# EAGLE design MCU (EAGLE 9.6.0)
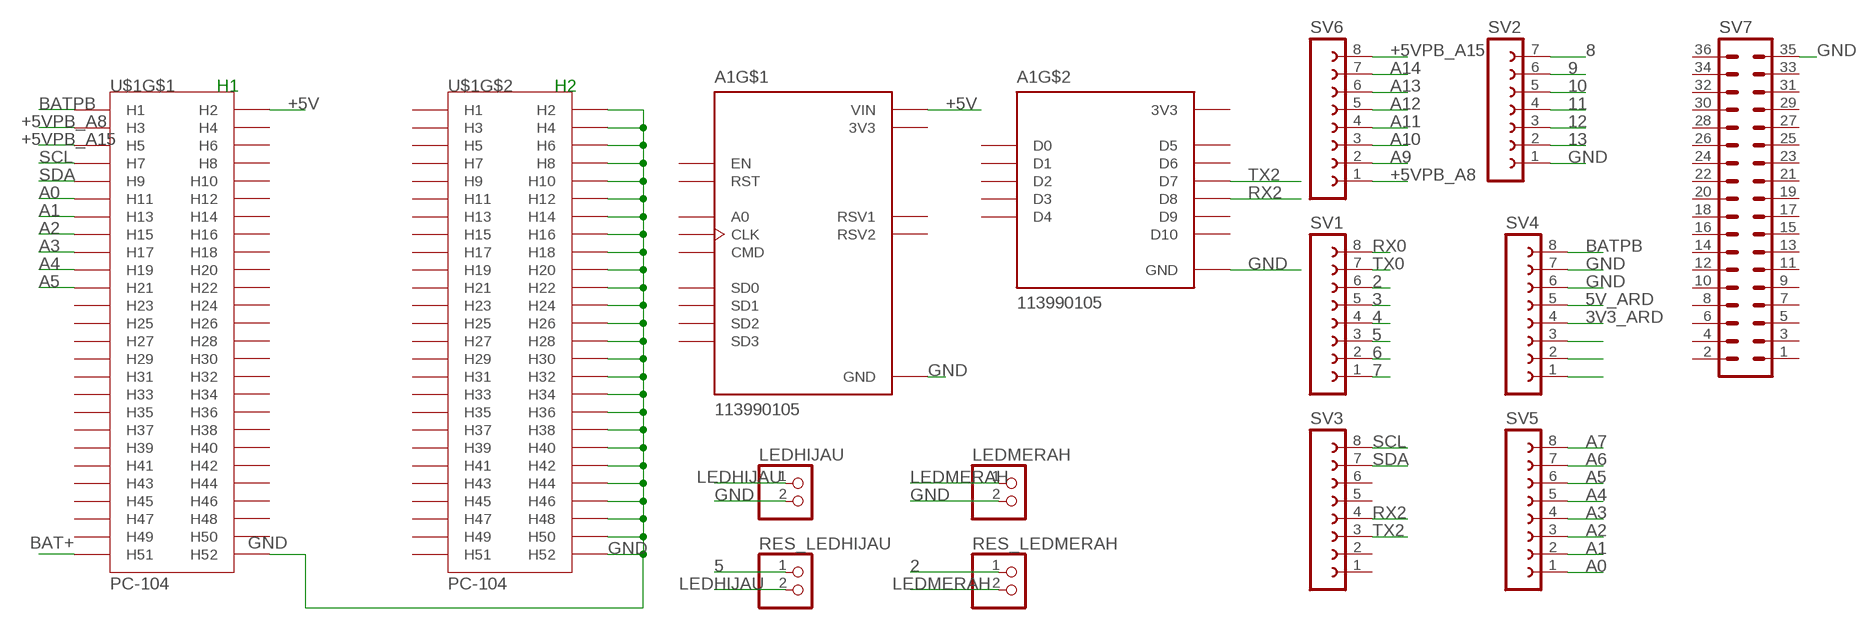
[diagram p0: schematic, sheet 1]

## Parts
A1  113990105  [SEEED_113990105]
LEDHIJAU  PINHD-1X2  [1X02]
LEDMERAH  PINHD-1X2  [1X02]
RES_LEDHIJAU  PINHD-1X2  [1X02]
RES_LEDMERAH  PINHD-1X2  [1X02]
SV1  FE08-1  [FE08]
SV2  FE07-1  [FE07]
SV3  FE08-1  [FE08]
SV4  FE08-1  [FE08]
SV5  FE08-1  [FE08]
SV6  FE08-1  [FE08]
SV7  MA18-2  [MA18-2]
U$1  PC-104  [PC-104]

## Nets
2: RES_LEDMERAH.1 SV1.6
3: SV1.5
3V3_ARD: SV4.4
4: SV1.4
5: RES_LEDHIJAU.1 SV1.3
5V_ARD: SV4.5
6: SV1.2
7: SV1.1
8: SV2.7
9: SV2.6
10: SV2.5
11: SV2.4
12: SV2.3
13: SV2.2
+5V: A1.J1_15(VIN) U$1.P$2(H2)
+5VPB_A8: SV6.1 U$1.P$3(H3)
+5VPB_A15: SV6.8 U$1.P$5(H5)
A0: SV5.1 U$1.P$11(H11)
A1: SV5.2 U$1.P$13(H13)
A2: SV5.3 U$1.P$15(H15)
A3: SV5.4 U$1.P$17(H17)
A4: SV5.5 U$1.P$19(H19)
A5: SV5.6 U$1.P$21(H21)
A6: SV5.7
A7: SV5.8
A9: SV6.2
A10: SV6.3
A11: SV6.4
A12: SV6.5
A13: SV6.6
A14: SV6.7
BAT+: U$1.P$51(H51)
BATPB: SV4.8 U$1.P$1(H1)
GND [GND]: A1.J1_10(GND) A1.J1_14(GND) A1.J2_7(GND) A1.J2_14(GND) LEDHIJAU.2 LEDMERAH.2 SV2.1 SV4.6 SV4.7 SV7.35 U$1.P$52(H52) U$1.P$54(H2) U$1.P$56(H4) U$1.P$58(H6) U$1.P$60(H8) U$1.P$62(H10) U$1.P$64(H12) U$1.P$66(H14) U$1.P$68(H16) U$1.P$70(H18) U$1.P$72(H20) U$1.P$74(H22) U$1.P$76(H24) U$1.P$78(H26) U$1.P$80(H28) U$1.P$82(H30) U$1.P$84(H32) U$1.P$86(H34) U$1.P$88(H36) U$1.P$90(H38) U$1.P$92(H40) U$1.P$94(H42) U$1.P$96(H44) U$1.P$98(H46) U$1.P$100(H48) U$1.P$102(H50) U$1.P$104(H52)
LEDHIJAU: LEDHIJAU.1 RES_LEDHIJAU.2
LEDMERAH: LEDMERAH.1 RES_LEDMERAH.2
N$6: SV4.3
N$7: SV4.2
N$8: SV4.1
RX0: SV1.8
RX2: A1.J2_11(D8) SV3.4
SCL: SV3.8 U$1.P$7(H7)
SDA: SV3.7 U$1.P$9(H9)
TX0: SV1.7
TX2: A1.J2_10(D7) SV3.3
Unconnected: A1.J1_1(A0) A1.J1_2(RSV1) A1.J1_3(RSV2) A1.J1_4(SD3) A1.J1_5(SD2) A1.J1_6(SD1) A1.J1_7(CMD) A1.J1_8(SD0) A1.J1_9(CLK) A1.J1_12(EN) A1.J1_13(RST) A1.J2_1(D0) A1.J2_2(D1) A1.J2_3(D2) A1.J2_4(D3) A1.J2_5(D4) A1.J2_8(D5) A1.J2_9(D6) A1.J2_12(D9) A1.J2_13(D10) SV3.1 SV3.2 SV3.5 SV3.6 SV7.1 SV7.2 SV7.3 SV7.4 SV7.5 SV7.6 SV7.7 SV7.8 SV7.9 SV7.10 SV7.11 SV7.12 SV7.13 SV7.14 SV7.15 SV7.16 SV7.17 SV7.18 SV7.19 SV7.20 SV7.21 SV7.22 SV7.23 SV7.24 SV7.25 SV7.26 SV7.27 SV7.28 SV7.29 SV7.30 SV7.31 SV7.32 SV7.33 SV7.34 SV7.36 U$1.P$4(H4) U$1.P$6(H6) U$1.P$8(H8) U$1.P$10(H10) U$1.P$12(H12) U$1.P$14(H14) U$1.P$16(H16) U$1.P$18(H18) U$1.P$20(H20) U$1.P$22(H22) U$1.P$23(H23) U$1.P$24(H24) U$1.P$25(H25) U$1.P$26(H26) U$1.P$27(H27) U$1.P$28(H28) U$1.P$29(H29) U$1.P$30(H30) U$1.P$31(H31) U$1.P$32(H32) U$1.P$33(H33) U$1.P$34(H34) U$1.P$35(H35) U$1.P$36(H36) U$1.P$37(H37) U$1.P$38(H38) U$1.P$39(H39) U$1.P$40(H40) U$1.P$41(H41) U$1.P$42(H42) U$1.P$43(H43) U$1.P$44(H44) U$1.P$45(H45) U$1.P$46(H46) U$1.P$47(H47) U$1.P$48(H48) U$1.P$49(H49) U$1.P$50(H50) U$1.P$53(H1) U$1.P$55(H3) U$1.P$57(H5) U$1.P$59(H7) U$1.P$61(H9) U$1.P$63(H11) U$1.P$65(H13) U$1.P$67(H15) U$1.P$69(H17) U$1.P$71(H19) U$1.P$73(H21) U$1.P$75(H23) U$1.P$77(H25) U$1.P$79(H27) U$1.P$81(H29) U$1.P$83(H31) U$1.P$85(H33) U$1.P$87(H35) U$1.P$89(H37) U$1.P$91(H39) U$1.P$93(H41) U$1.P$95(H43) U$1.P$97(H45) U$1.P$99(H47) U$1.P$101(H49) U$1.P$103(H51)

## Notes on the sheet
- H1 | H2

## Power pins joined to a net without a drawn wire
3V3: A1.J1_11(3V3) A1.J2_6(3V3) A1.J2_15(3V3)

## Library data of the parts
A1 = 113990105:113990105: NodeMCU v2 - Lua based ESP8266 development kit Check availability <https://pricing.snapeda.com/parts/NodeMCU%20v2/Seeed%20Technology/view-part?ref=eda>; AVAILABILITY: Not in stock; DESCRIPTION: An open-source firmware and development kit that helps you to Prototype your IOT product within a few Lua script lines; MF: Seeed Technology; MP: NodeMCU v2; PACKAGE: None; PRICE: None
LEDHIJAU LEDMERAH RES_LEDHIJAU RES_LEDMERAH = pinhead:PINHD-1X2: PIN HEADER
SV1 SV3-SV6 = con-lsta:FE08-1: FEMALE HEADER; OC_FARNELL: unknown; OC_NEWARK: unknown
SV2 = con-lsta:FE07-1: FEMALE HEADER; OC_FARNELL: unknown; OC_NEWARK: unknown
SV7 = con-lstb:MA18-2: PIN HEADER; OC_FARNELL: unknown; OC_NEWARK: unknown
U$1 = Locana Board:PC-104

## Net classes
0 default: width 0.203 mm
1 GND: width 0.254 mm

## Board
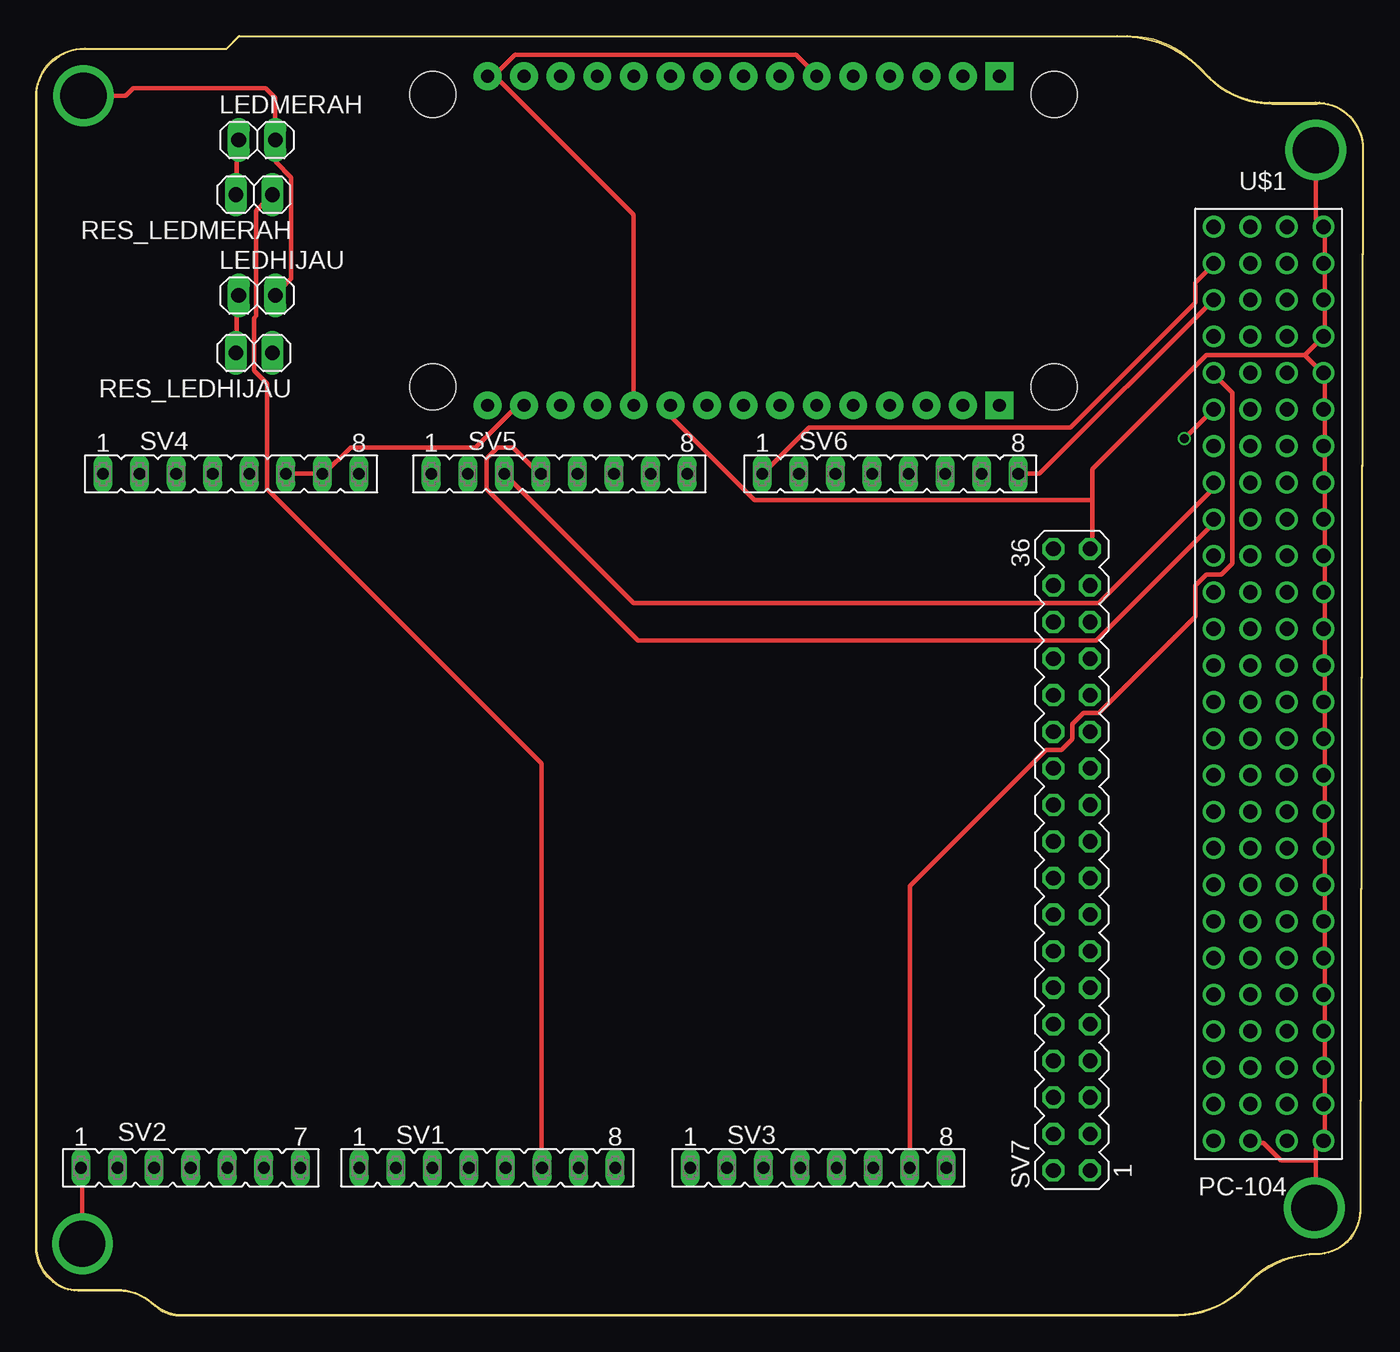
[diagram p1: board, top side]
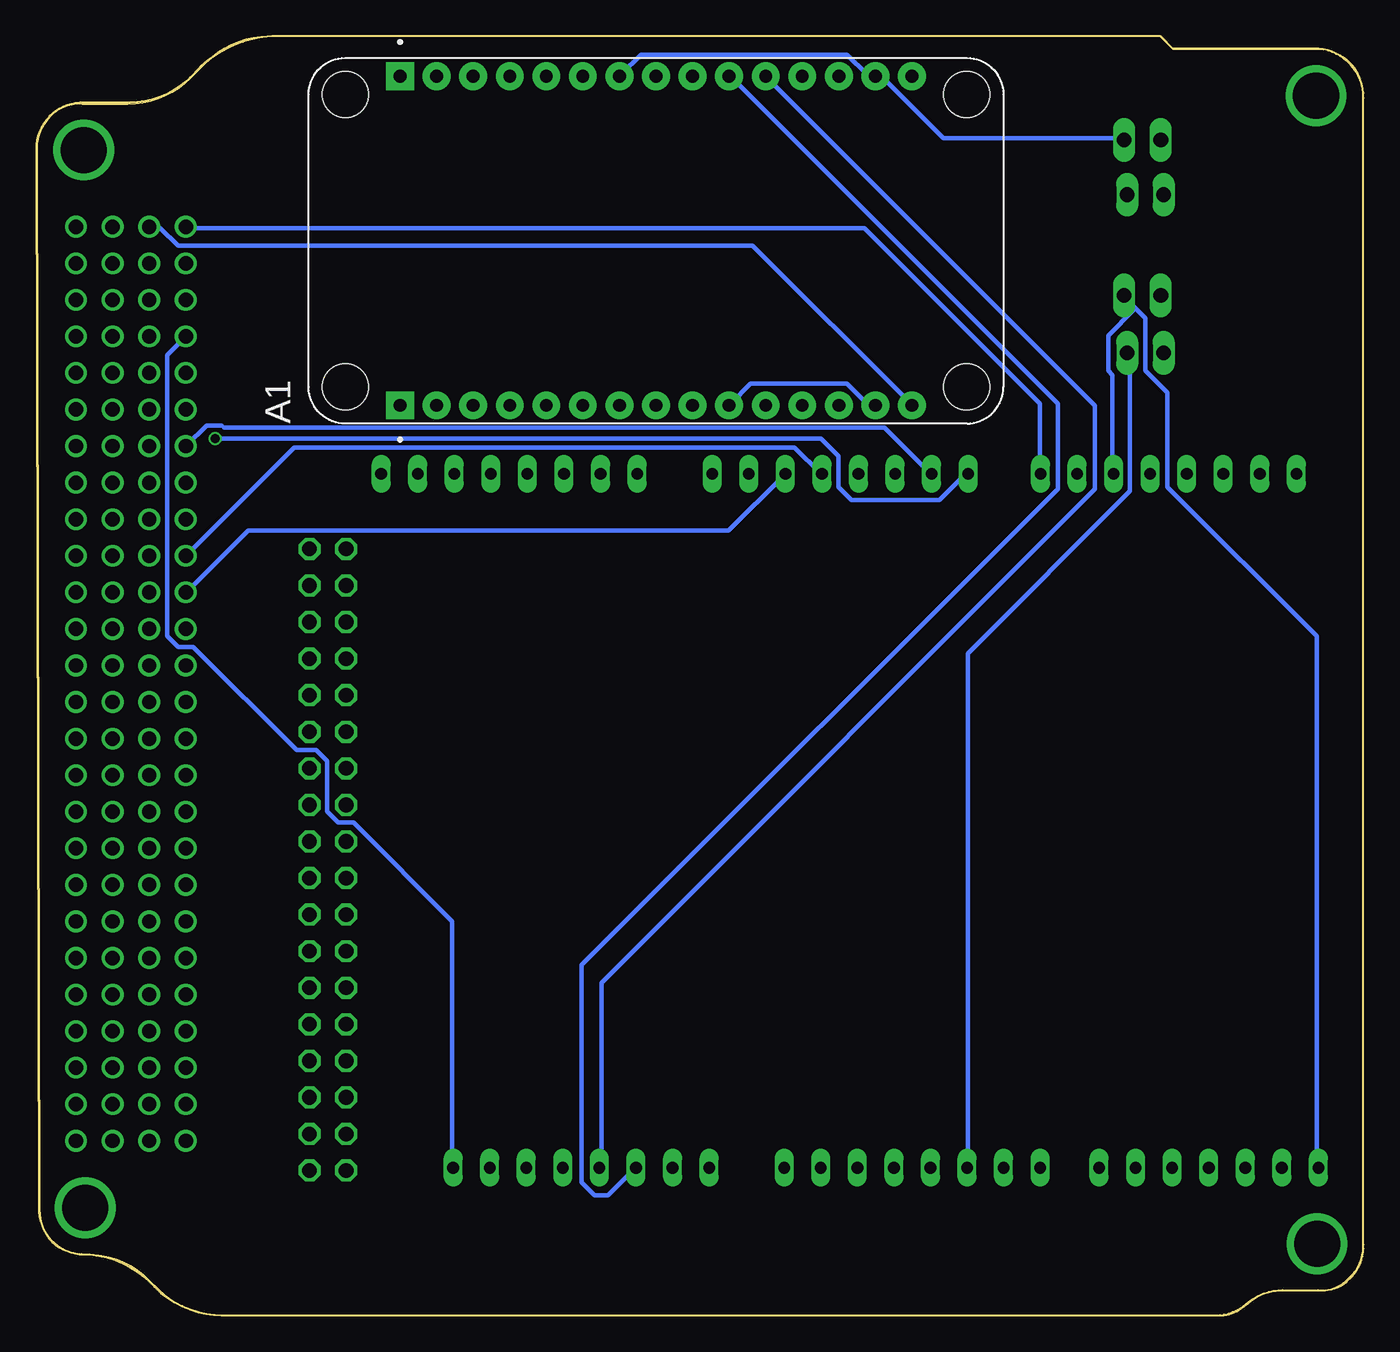
[diagram p2: board, bottom side, seen from below]

Size 92.22 x 88.9 mm. Coordinates in mm from the lower left corner, seen from the top.
Outline: 89.1,84.2 arc-90 92.22,81.05 92.02,7.52 arc-90 89,4.28 88.71,4.28 arc45 84.38,2.48 83.69,1.8 arc-45 79.36,0 9.88,0 arc-40 8.51,0.5 8.37,0.63 arc45 5.71,1.73 3.2,1.73 arc-90 0.05,4.83 0.05,84.83 arc-90 3.17,88 13.22,88 14.1,88.87 76.06,88.87 arc-45 80.39,87.08 81.5,85.97 arc45 85.84,84.18 89.02,84.18
Outline: 0,4.93 0,84.61 arc-90 3.41,88.03 13.25,88.03 14.12,88.9 75.11,88.9 arc-45 80.81,86.72 81.52,86.01 arc45 85.7,84.28 88.88,84.28 arc-90 92.17,81.13 92,7.66 arc-45 91.1,5.13 arc-35 89.21,4.28 89.05,4.28 arc45 84.27,2.3 83.98,2.01 arc-45 79.2,0.03 10.28,0.03 arc-41 8.04,0.87 arc41 5.62,1.78 3.15,1.78 arc-45 1.18,2.34 0.82,2.71 arc-45 0,4.93
Copper layers (1*16): Top 0.035mm / dielectric 1.5mm / Bottom 0.035mm
Design rules "default *": minimum track width 12mil, minimum drill 0.6mm, track to track 12mil, track to pad 12mil, pad to pad 12mil, via to via 12mil, smd to smd 12mil, copper to edge 40mil, drill to drill 12mil, minimum pad ring 10mil, minimum via ring 6mil, stop-mask expansion 4mil, vias tented up to drill 0mil, thermal gap 10mil

### Footprints (pad centres in the part's own frame; a part is rotated, then mirrored left to right if it is on the bottom)
SEEED_113990105 = drill 0.889 pad 1.93 square: J1_1 -11.43,17.78; J2_1 11.43,17.78 | drill 0.889 pad 1.93: J1_2 -11.43,15.24; J1_3 -11.43,12.7; J1_4 -11.43,10.16; J1_5 -11.43,7.62; J1_6 -11.43,5.08; J1_7 -11.43,2.54; J1_8 -11.43,0; J1_9 -11.43,-2.54; J1_10 -11.43,-5.08; J1_11 -11.43,-7.62; J1_12 -11.43,-10.16; J1_13 -11.43,-12.7; J1_14 -11.43,-15.24; J1_15 -11.43,-17.78; J2_2 11.43,15.24; J2_3 11.43,12.7; J2_4 11.43,10.16; J2_5 11.43,7.62; J2_6 11.43,5.08; J2_7 11.43,2.54; J2_8 11.43,0; J2_9 11.43,-2.54; J2_10 11.43,-5.08; J2_11 11.43,-7.62; J2_12 11.43,-10.16; J2_13 11.43,-12.7; J2_14 11.43,-15.24; J2_15 11.43,-17.78 | hole 3.2: -10.16,21.59; 10.16,21.59; 10.16,-21.59; -10.16,-21.59
1X02 = drill 1.016 long: 1 -1.27,0; 2 1.27,0
FE08 = drill 0.813 long: 1 -8.89,0; 2 -6.35,0; 3 -3.81,0; 4 -1.27,0; 5 1.27,0; 6 3.81,0; 7 6.35,0; 8 8.89,0
FE07 = drill 0.813 long: 1 -7.62,0; 2 -5.08,0; 3 -2.54,0; 4 0,0; 5 2.54,0; 6 5.08,0; 7 7.62,0
MA18-2 = drill 1.016 octagon: 1 -21.59,-1.27; 2 -21.59,1.27; 3 -19.05,-1.27; 4 -19.05,1.27; 5 -16.51,-1.27; 6 -16.51,1.27; 7 -13.97,-1.27; 8 -13.97,1.27; 9 -11.43,-1.27; 10 -11.43,1.27; 11 -8.89,-1.27; 12 -8.89,1.27; 13 -6.35,-1.27; 14 -6.35,1.27; 15 -3.81,-1.27; 16 -3.81,1.27; 17 -1.27,-1.27; 18 -1.27,1.27; 19 1.27,-1.27; 20 1.27,1.27; 21 3.81,-1.27; 22 3.81,1.27; 23 6.35,-1.27; 24 6.35,1.27; 25 8.89,-1.27; 26 8.89,1.27; 27 11.43,-1.27; 28 11.43,1.27; 29 13.97,-1.27; 30 13.97,1.27; 31 16.51,-1.27; 32 16.51,1.27; 33 19.05,-1.27; 34 19.05,1.27; 35 21.59,-1.27; 36 21.59,1.27
PC-104 = drill 1: P$1 -3.81,31.75; P$2 -1.27,31.75; P$3 -3.81,29.21; P$4 -1.27,29.21; P$5 -3.81,26.67; P$6 -1.27,26.67; P$7 -3.81,24.13; P$8 -1.27,24.13; P$9 -3.81,21.59; P$10 -1.27,21.59; P$11 -3.81,19.05; P$12 -1.27,19.05; P$13 -3.81,16.51; P$14 -1.27,16.51; P$15 -3.81,13.97; P$16 -1.27,13.97; P$17 -3.81,11.43; P$18 -1.27,11.43; P$19 -3.81,8.89; P$20 -1.27,8.89; P$21 -3.81,6.35; P$22 -1.27,6.35; P$23 -3.81,3.81; P$24 -1.27,3.81; P$25 -3.81,1.27; P$26 -1.27,1.27; P$27 -3.81,-1.27; P$28 -1.27,-1.27; P$29 -3.81,-3.81; P$30 -1.27,-3.81; P$31 -3.81,-6.35; P$32 -1.27,-6.35; P$33 -3.81,-8.89; P$34 -1.27,-8.89; P$35 -3.81,-11.43; P$36 -1.27,-11.43; P$37 -3.81,-13.97; P$38 -1.27,-13.97; P$39 -3.81,-16.51; P$40 -1.27,-16.51; P$41 -3.81,-19.05; P$42 -1.27,-19.05; P$43 -3.81,-21.59; P$44 -1.27,-21.59; P$45 -3.81,-24.13; P$46 -1.27,-24.13; P$47 -3.81,-26.67; P$48 -1.27,-26.67; P$49 -3.81,-29.21; P$50 -1.27,-29.21; P$51 -3.81,-31.75; P$52 -1.27,-31.75; P$53 1.27,31.75; P$54 3.81,31.75; P$55 1.27,29.21; P$56 3.81,29.21; P$57 1.27,26.67; P$58 3.81,26.67; P$59 1.27,24.13; P$60 3.81,24.13; P$61 1.27,21.59; P$62 3.81,21.59; P$63 1.27,19.05; P$64 3.81,19.05; P$65 1.27,16.51; P$66 3.81,16.51; P$67 1.27,13.97; P$68 3.81,13.97; P$69 1.27,11.43; P$70 3.81,11.43; P$71 1.27,8.89; P$72 3.81,8.89; P$73 1.27,6.35; P$74 3.81,6.35; P$75 1.27,3.81; P$76 3.81,3.81; P$77 1.27,1.27; P$78 3.81,1.27; P$79 1.27,-1.27; P$80 3.81,-1.27; P$81 1.27,-3.81; P$82 3.81,-3.81; P$83 1.27,-6.35; P$84 3.81,-6.35; P$85 1.27,-8.89; P$86 3.81,-8.89; P$87 1.27,-11.43; P$88 3.81,-11.43; P$89 1.27,-13.97; P$90 3.81,-13.97; P$91 1.27,-16.51; P$92 3.81,-16.51; P$93 1.27,-19.05; P$94 3.81,-19.05; P$95 1.27,-21.59; P$96 3.81,-21.59; P$97 1.27,-24.13; P$98 3.81,-24.13; P$99 1.27,-26.67; P$100 3.81,-26.67; P$101 1.27,-29.21; P$102 3.81,-29.21; P$103 1.27,-31.75; P$104 3.81,-31.75

### Placement (x,y rotation side)
A1  49.15,74.68 90 bottom
LEDHIJAU  15.35,70.88 0 top
LEDMERAH  15.35,81.68 0 top
RES_LEDHIJAU  15.15,66.88 180 top
RES_LEDMERAH  15.15,77.88 180 top
SV1  31.35,10.28 0 top
SV2  10.75,10.28 0 top
SV3  54.35,10.28 0 top
SV4  13.55,58.48 0 top
SV5  36.35,58.48 0 top
SV6  59.35,58.48 0 top
SV7  71.95,31.68 90 top
U$1  85.62,43.9 0 top

### Tracks (layer width: path | path; a pad name or v marks a point on that pad's centre or on a via)
2
  Top 0.305: SV1.6 35.11,10.34 35.11,38.38 16.07,57.43 16.07,64.74 15.15,65.66 15.15,69.32 15.3,69.47 15.3,76.78 16.37,77.85 RES_LEDMERAH.1
3V3
  Top 0.305: 31.76,86.23 31.91,86.23 33.29,87.6 52.79,87.6 54.16,86.23 A1.J2_6 | 31.76,86.23 31.46,86.23 A1.J2_15 31.76,86.23 | 31.76,86.23 41.52,76.48 41.52,63.37 A1.J1_11
5
  Bottom 0.305: SV1.3 27.5,10.34 27.5,46 16.22,57.28 16.22,66.72 16.37,66.88 RES_LEDHIJAU.1
+5V
  Bottom 0.305: U$1.P$2 84.34,75.56 83.58,75.56 82.36,74.34 42.43,74.34 31.46,63.37 A1.J1_15
+5VPB_A8
  Top 0.305: SV6.1 50.51,58.5 53.71,61.7 71.84,61.7 80.53,70.38 80.53,71.75 81.75,72.97 U$1.P$3
+5VPB_A15
  Top 0.305: SV6.8 68.34,58.5 69.71,58.5 81.75,70.53 U$1.P$5
A0  (via drill 0.6)
  Top 0.305: v79.77,60.93 81.75,62.91 U$1.P$11
  Bottom 0.305: v79.77,60.93 37.71,60.93 36.49,59.71 36.49,57.58 35.57,56.67 29.48,56.67 27.8,58.34 27.5,58.34 SV5.1
A1
  Bottom 0.305: SV5.2 30.09,58.5 33.29,61.7 79.16,61.7 79.31,61.85 80.38,61.85 81.75,60.48 U$1.P$13
A2
  Top 0.305: SV5.3 32.68,58.34 41.52,49.5 73.83,49.5 81.75,57.43 81.75,57.73 U$1.P$15
A3
  Top 0.305: SV5.4 34.96,58.5 33.13,60.32 32.07,60.32 31.3,59.56 31.3,57.43 41.82,46.91 73.67,46.91 81.75,54.99 81.75,55.29 U$1.P$17
A4
  Bottom 0.305: SV5.5 37.71,58.5 39.53,60.32 74.28,60.32 81.75,52.86 U$1.P$19
A5
  Bottom 0.305: SV5.6 40.3,58.34 44.11,54.53 77.48,54.53 81.75,50.27 U$1.P$21
BATPB
  Bottom 0.305: SV4.8 22.47,58.5 22.47,63.37 34.66,75.56 81.75,75.56 U$1.P$1
GND  (via drill 3.2)
  Top 0.305: v88.9,80.98 88.91,80.9 88.91,76.17 89.37,75.72 U$1.P$54 89.52,75.56 89.52,73.13 U$1.P$56 89.52,72.97 89.52,70.69 U$1.P$58 89.52,70.53 89.52,68.1 U$1.P$60 89.37,67.94 88.15,66.72 | 73.37,56.67 73.37,58.8 81.29,66.72 88.15,66.72 | 73.37,56.67 73.37,53.31 SV7.35 | 88.15,66.72 89.37,65.51 U$1.P$62 89.52,65.35 89.52,63.07 U$1.P$64 89.52,62.91 89.52,60.48 U$1.P$66 89.52,60.32 89.52,57.89 U$1.P$68 89.52,57.73 89.52,55.45 U$1.P$70 89.52,55.29 89.52,52.86 U$1.P$72 89.52,52.7 89.52,50.27 U$1.P$74 89.52,50.11 89.52,47.83 U$1.P$76 89.52,47.67 89.52,45.24 U$1.P$78 89.52,45.08 89.52,42.65 U$1.P$80 89.52,42.49 89.52,40.21 U$1.P$82 89.52,40.05 89.52,37.62 U$1.P$84 89.52,37.46 89.52,35.03 U$1.P$86 89.52,34.87 89.52,32.59 U$1.P$88 89.52,32.43 89.52,30 U$1.P$90 89.52,29.84 89.52,27.41 U$1.P$92 89.52,27.25 89.52,24.97 U$1.P$94 89.52,24.81 89.52,22.38 U$1.P$96 89.52,22.22 89.52,19.79 U$1.P$98 89.52,19.63 89.52,17.35 U$1.P$100 89.52,17.19 89.52,14.76 U$1.P$102 89.52,14.6 89.52,12.17 U$1.P$104 89.37,12.01 88.91,11.56 88.91,10.79 | 88.91,10.79 88.91,7.59 v88.8,7.5 | 88.91,10.79 86.47,10.79 85.25,12.01 84.49,12.01 U$1.P$52 | SV4.6 17.44,58.5 19.88,58.5 SV4.7 20.03,58.5 21.86,60.32 30.54,60.32 33.44,63.22 33.9,63.22 A1.J1_14 | LEDHIJAU.2 16.68,70.99 17.74,72.06 17.74,79.07 16.68,80.14 16.68,81.66 LEDMERAH.2 16.62,84.61 15.95,85.28 6.75,85.28 6.22,84.75 v3.3,84.75 | 73.37,56.67 49.9,56.67 44.11,62.46 44.11,63.22 A1.J1_10 | v3.22,5 3.22,10.18 SV2.1
  Bottom 0.305: A1.J2_7 51.57,86.23 50.2,87.6 35.88,87.6 34.51,86.23 34.05,86.23 A1.J2_14 33.9,86.08 33.44,86.08 29.17,81.81 16.68,81.81 LEDMERAH.2 | A1.J1_14 34.05,63.37 34.51,63.37 35.88,64.74 42.58,64.74 43.95,63.37 A1.J1_10 | SV2.1 3.26,10.34 3.26,47.22 13.63,57.58 13.63,64.13 15.15,65.66 15.15,69.32 16.68,70.84 LEDHIJAU.2 15.91,69.93 17.74,68.1 17.74,65.66 17.44,65.35 17.44,58.5 SV4.6
LEDHIJAU
  Top 0.305: RES_LEDHIJAU.2 13.93,67.03 13.93,70.84 LEDHIJAU.1
LEDMERAH
  Top 0.305: RES_LEDMERAH.2 13.93,78 13.93,81.66 LEDMERAH.1
RX2
  Bottom 0.305: SV3.4 52.95,10.34 52.95,23.14 18.66,57.43 18.66,63.22 41.52,86.08 A1.J2_11
SCL
  Bottom 0.305: SV3.8 63.31,10.34 63.31,27.41 70.17,34.26 71.23,34.26 72,35.03 72,38.53 72.76,39.29 74.13,39.29 81.29,46.46 82.36,46.46 83.12,47.22 83.12,66.72 81.9,67.94 U$1.P$7
SDA
  Top 0.305: SV3.7 60.72,10.34 60.72,29.84 70.17,39.29 71.23,39.29 72,40.05 72,41.12 72.76,41.88 73.83,41.88 80.53,48.59 80.53,50.72 81.29,51.48 82.36,51.48 83.12,52.25 83.12,64.13 81.9,65.35 U$1.P$9
TX2
  Bottom 0.305: SV3.3 50.66,10.18 52.49,8.36 53.4,8.36 54.32,9.27 54.32,24.36 21.25,57.43 21.25,63.37 43.95,86.08 A1.J2_10

### Text on the board
bTest: VBAT | 5V | SCL | 3.3V | SDA | CAN_HIGH | 5V | GND | 3.3v | SDA | GND | CAN_HIGH | CAN_LOW | GND | SDL | CAN_LOW | 5V
Name: LOCANA + ICU BOARD